# EAGLE schematic resetCircuit (EAGLE 9.3.0)
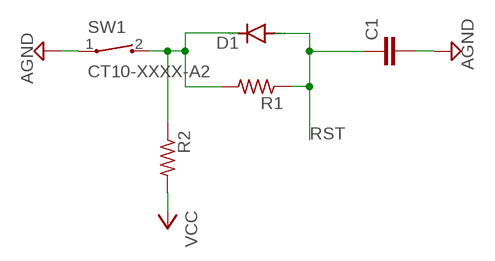
[diagram p0: schematic, sheet 1]

## Parts
C1  C-EU01005  [C01005]
D1  DIODE-DO-214AC  [DO-214AC]
R1  R-US_01005  [R01005]
R2  R-US_01005  [R01005]
SW1  CT10-XXXX-A2  [CT10-XXXX-A2]

## Nets
AGND: C1.2 SW1.1
N$1: D1.C R1.2 R2.1 SW1.2
RST: C1.1 D1.A R1.1
VCC: R2.2

## Library data of the parts
C1 = rcl:C-EU: CAPACITOR, European symbol; SPICEPREFIX: C
D1 = diode:DIODE-: DIODE
R1 R2 = rcl:R-US_: RESISTOR, American symbol; SPICEPREFIX: R
SW1 = switch-coto:CT10-XXXX-: CT10 Series Molded Switch Source: www.cotorelay.com .. Coto_Technology__CT10-1530-G1.pdf